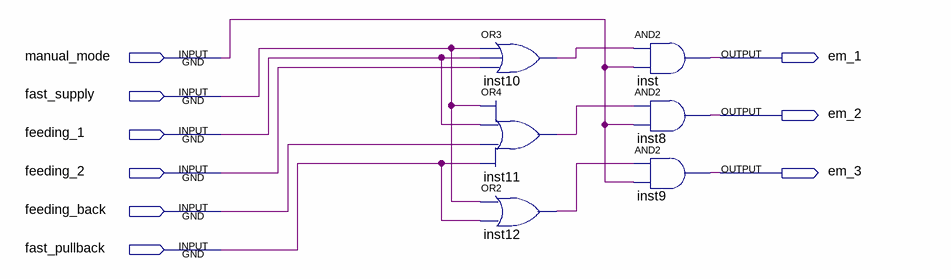
[diagram p0: schematic sheet]
// Quartus schematic manual_mode.bdf as structural Verilog: 6 symbols, 9 pins
module manual_mode (
  input  manual_mode,
  input  fast_supply,
  input  feeding_1,
  input  feeding_2,
  input  feeding_back,
  input  fast_pullback,
  output em_1,
  output em_2,
  output em_3
);

  wire inst10_out, inst11_out, inst12_out;

  or inst10 (inst10_out, fast_supply, feeding_1, feeding_2);
  or inst11 (inst11_out, fast_supply, feeding_1, feeding_back, fast_pullback);
  or inst12 (inst12_out, fast_supply, fast_pullback);
  and inst (em_1, inst10_out, manual_mode);
  and inst8 (em_2, inst11_out, manual_mode);
  and inst9 (em_3, inst12_out, manual_mode);
endmodule
